# EAGLE design kiln_rpi_breakout_atmega328 (EAGLE 7.1.0)
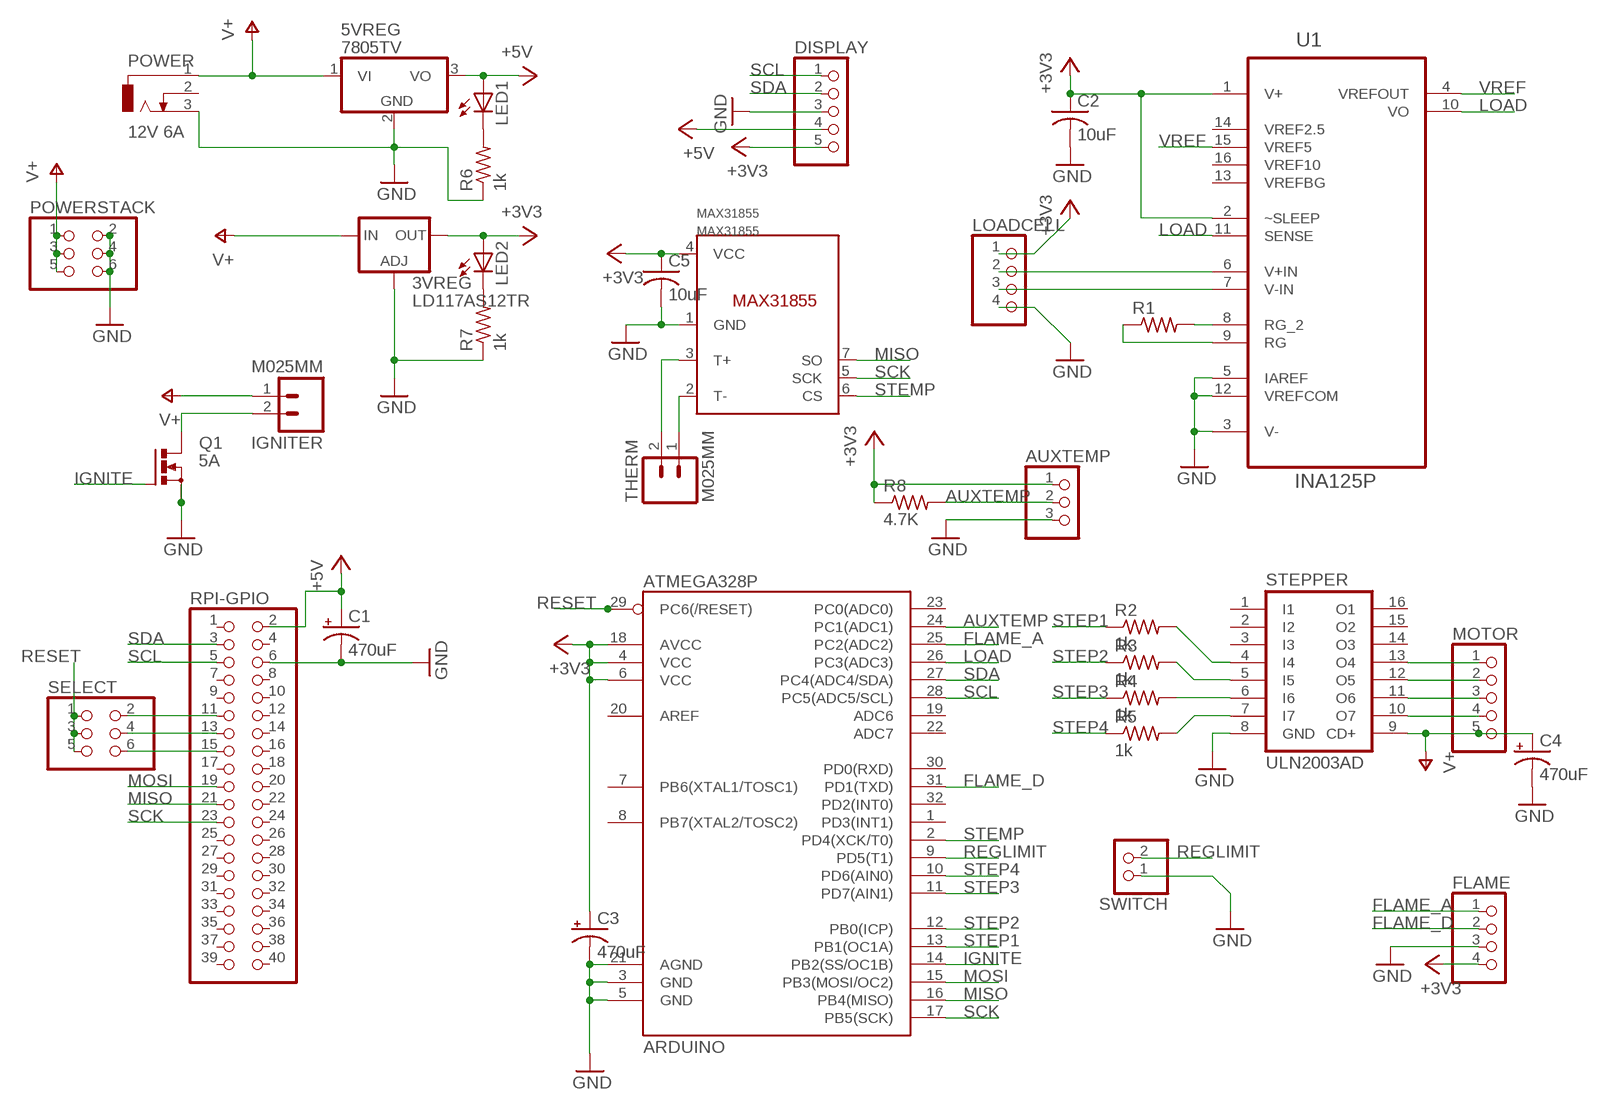
[diagram p0: schematic, sheet 1]

## Parts
3VREG  LD117AS12TR  [SOT223]
5VREG  7805TV  [TO220V]
ARDUINO  ATMEGA328P  ATMEGA328_SMT  [TQFP32-08]
AUXTEMP  PINHD-1X3  [1X03]
C1  470uF  CPOL-USE3.5-8  [E3,5-8]
C2  10uF  C-US025-030X050  [C025-030X050]
C3  470uF  CPOL-USE3.5-8  [E3,5-8]
C4  470uF  CPOL-USE3.5-8  [E3,5-8]
C5  10uF  C-US025-030X050  [C025-030X050]
DISPLAY  PINHD-1X5  [1X05]
FLAME  PINHD-1X4/90  [1X04/90]
IGNITER  M025MM  [SCREWTERMINAL-5MM-2]
LED1  LED3MM  [LED3MM]
LED2  LED3MM  [LED3MM]
LOADCELL  PINHD-1X4/90  [1X04/90]
MAX31855  MAX31855  [SOIC8]
MOTOR  PINHD-1X5/90  [1X05/90]
POWER  12V 6A  DCJ0303  [DCJ0303]
POWERSTACK  PINHD-2X3  [2X03]
Q1  5A  PMOSFET_NTO220BV  [TO220BV]
R1  R-US_0204/7  [0204/7]
R2  1k  R-US_0207/7  [0207/7]
R3  1k  R-US_0207/7  [0207/7]
R4  1k  R-US_0207/7  [0207/7]
R5  1k  R-US_0207/7  [0207/7]
R6  1k  R-US_0207/7  [0207/7]
R7  1k  R-US_0207/7  [0207/7]
R8  4.7K  R-US_0207/2V  [0207/2V]
RPI-GPIO  PINHD-2X20  [2X20]
SELECT  PINHD-2X3  [2X03]
STEPPER  ULN2003AD  [SO16]
SWITCH  PINHD-1X2/90  [1X02/90]
THERM  M025MM  [SCREWTERMINAL-5MM-2]
U1  INA125P  [DIP254P762X508-16]

## Nets
+3V3: 3VREG.4(OUT) ARDUINO.4(VCC) ARDUINO.6(VCC) ARDUINO.18(AVCC) AUXTEMP.1 C2.1 C3.+ C5.1 DISPLAY.5 FLAME.4 LED2.A LOADCELL.1 MAX31855.4(VCC) R8.1 U1.1(V+) U1.2(~SLEEP)
+5V: 5VREG.3(VO) C1.+ DISPLAY.4 LED1.A RPI-GPIO.2
AUXTEMP: ARDUINO.24(PC1(ADC1)) AUXTEMP.2 R8.2
FLAME_A: ARDUINO.25(PC2(ADC2)) FLAME.1
FLAME_D: ARDUINO.31(PD1(TXD)) FLAME.2
GND: 3VREG.1(ADJ) 5VREG.2(GND) ARDUINO.3(GND) ARDUINO.5(GND) ARDUINO.21(AGND) AUXTEMP.3 C1.- C2.2 C3.- C4.- C5.2 DISPLAY.3 FLAME.3 LOADCELL.4 MAX31855.1(GND) POWER.3 POWERSTACK.2 POWERSTACK.4 POWERSTACK.6 Q1.S R6.1 R7.1 RPI-GPIO.6 STEPPER.8(GND) SWITCH.1 U1.3(V-) U1.5(IAREF) U1.12(VREFCOM)
IGNITE: ARDUINO.14(PB2(SS/OC1B)) Q1.G
LOAD: ARDUINO.26(PC3(ADC3)) U1.10(VO) U1.11(SENSE)
MISO: ARDUINO.16(PB4(MISO)) MAX31855.7(SO) RPI-GPIO.21
MOSI: ARDUINO.15(PB3(MOSI/OC2)) RPI-GPIO.19
N$1: MOTOR.1 STEPPER.13(O4)
N$2: MOTOR.2 STEPPER.12(O5)
N$3: MOTOR.3 STEPPER.11(O6)
N$4: MOTOR.4 STEPPER.10(O7)
N$5: LED1.K(C) R6.2
N$6: LOADCELL.2 U1.6(V+IN)
N$7: LOADCELL.3 U1.7(V-IN)
N$8: MAX31855.3(T+) THERM.2
N$9: IGNITER.2 Q1.D
N$10: R1.2 U1.8(RG_2)
N$11: R5.2 STEPPER.7(I7)
N$12: R4.2 STEPPER.6(I6)
N$13: R3.2 STEPPER.5(I5)
N$14: R2.2 STEPPER.4(I4)
N$15: R1.1 U1.9(RG)
N$16: MAX31855.2(T-) THERM.1
N$17: LED2.K(C) R7.2
REGLIMIT: ARDUINO.9(PD5(T1)) SWITCH.2
RESET: ARDUINO.29(PC6(/RESET)) SELECT.1 SELECT.3 SELECT.5
RESET1: RPI-GPIO.11 SELECT.2
RESET2: RPI-GPIO.13 SELECT.4
RESET3: RPI-GPIO.15 SELECT.6
SCK: ARDUINO.17(PB5(SCK)) MAX31855.5(SCK) RPI-GPIO.23
SCL: ARDUINO.28(PC5(ADC5/SCL)) DISPLAY.1 RPI-GPIO.5
SDA: ARDUINO.27(PC4(ADC4/SDA)) DISPLAY.2 RPI-GPIO.3
STEMP: ARDUINO.2(PD4(XCK/T0)) MAX31855.6(CS)
STEP1: ARDUINO.13(PB1(OC1A)) R2.1
STEP2: ARDUINO.12(PB0(ICP)) R3.1
STEP3: ARDUINO.11(PD7(AIN1)) R4.1
STEP4: ARDUINO.10(PD6(AIN0)) R5.1
V+: 3VREG.3(IN) 5VREG.1(VI) C4.+ IGNITER.1 MOTOR.5 POWER.1 POWERSTACK.1 POWERSTACK.3 POWERSTACK.5 STEPPER.9(CD+)
VREF: U1.4(VREFOUT) U1.15(VREF5)
Unconnected: ARDUINO.1(PD3(INT1)) ARDUINO.7(PB6(XTAL1/TOSC1)) ARDUINO.8(PB7(XTAL2/TOSC2)) ARDUINO.19(ADC6) ARDUINO.20(AREF) ARDUINO.22(ADC7) ARDUINO.23(PC0(ADC0)) ARDUINO.30(PD0(RXD)) ARDUINO.32(PD2(INT0)) POWER.2 RPI-GPIO.1 RPI-GPIO.4 RPI-GPIO.7 RPI-GPIO.8 RPI-GPIO.9 RPI-GPIO.10 RPI-GPIO.12 RPI-GPIO.14 RPI-GPIO.16 RPI-GPIO.17 RPI-GPIO.18 RPI-GPIO.20 RPI-GPIO.22 RPI-GPIO.24 RPI-GPIO.25 RPI-GPIO.26 RPI-GPIO.27 RPI-GPIO.28 RPI-GPIO.29 RPI-GPIO.30 RPI-GPIO.31 RPI-GPIO.32 RPI-GPIO.33 RPI-GPIO.34 RPI-GPIO.35 RPI-GPIO.36 RPI-GPIO.37 RPI-GPIO.38 RPI-GPIO.39 RPI-GPIO.40 STEPPER.1(I1) STEPPER.2(I2) STEPPER.3(I3) STEPPER.14(O3) STEPPER.15(O2) STEPPER.16(O1)

## Power pins joined to a net without a drawn wire
VREF2.5: U1.14(VREF2.5)
VREF10: U1.16(VREF10)
VREFBG: U1.13(VREFBG)

## Library data of the parts
3VREG = v-reg:LD117A?*: Low drop fixed and adjustable positive voltage regulators 1 A Source: http://www.st.com/stonline/products/literature/ds/7194/ld1117axx.pdf
5VREG = linear:78*: Positive VOLTAGE REGULATOR Source: http://cache.national.com/ds/LM/LM78L05.pdf http://www.fairchildsemi.com/ds/LM/LM7805.pdf
ARDUINO = SparkFun-DigitalIC:ATMEGA328_SMT: 32-Pin Atmega328 part Commonly used on Arduino compatible boards Available in QFP and QFN packages TQFP is IC-09069 QFN is non-stock; PROD_ID: IC-09069
AUXTEMP = pinhead:PINHD-1X3: PIN HEADER
C1 C3 C4 = rcl:CPOL-US: POLARIZED CAPACITOR, American symbol
C2 C5 = rcl:C-US: CAPACITOR, American symbol
DISPLAY MOTOR = pinhead:PINHD-1X5: PIN HEADER
FLAME LOADCELL = pinhead:PINHD-1X4: PIN HEADER
IGNITER THERM = SparkFun-Connectors:M02: Standard 2-pin 0.1" header. Use with - straight break away headers ( PRT-00116) - right angle break away headers (PRT-00553) - swiss pins (PRT-00743) - machine pins (PRT-00117) - female headers (PRT-00115) Molex polarized connector foot print use with: PRT-08233 with associated crimp pins and housings. 2.54_SCREWTERM for use with PRT-10571. 3.5mm Screw Terminal footprints for PRT-08084 5mm Screw Terminal footprints for use with PRT-08432; STOREFRONT_ID: PRT-08432
LED1 LED2 = led:LED: LED OSRAM: - CHIPLED LG R971, LG N971, LY N971, LG Q971, LY Q971, LO R971, LY R971 LH N974, LH R974 LS Q976, LO Q976, LY Q976 LO Q996 - Hyper CHIPLED LW Q18S LB Q993, LB Q99A, LB R99A - SideLED LS A670, LO A670, LY A670, LG A670, LP A670 LB A673, LV A673, LT A673, LW A673 LH A674 LY A675 LS A676, LA A676, LO A676, LY A676, LW A676 LS A679, LY A679, LG A679 - Hyper Micro SIDELED® LS Y876, LA Y876, LO Y876, LY Y876 LT Y87S - SmartLED LW L88C, LW L88S LB L89C, LB L89S, LG L890 LS L89K, LO L89K, LY L89K LS L896, LA L896, LO L896, LY L896 - TOPLED LS T670, LO T670, LY T670, LG T670, LP T670 LSG T670, LSP T670, LSY T670, LOP T670, LYG T670 LG T671, LOG T671, LSG T671 LB T673, LV T673, LT T673, LW T673 LH T674 LS T676, LA T676, LO T676, LY T676, LB T676, LH T676, LSB T676, LW T676 LB T67C, LV T67C, LT T67C, LS T67K, LO T67K, LY T67K, LW E67C LS E67B, LA E67B, LO E67B, LY E67B, LB E67C, LV E67C, LT E67C LW T67C LS T679, LY T679, LG T679 LS T770, LO T770, LY T770, LG T770, LP T770 LB T773, LV T773, LT T773, LW T773 LH T774 LS E675, LA E675, LY E675, LS T675 LS T776, LA T776, LO T776, LY T776, LB T776 LHGB T686 LT T68C, LB T68C - Hyper Mini TOPLED® LB M676 - Mini TOPLED Santana® LG M470 LS M47K, LO M47K, LY M47K Source: http://www.osram.convergy.de LUXEON: - LUMILED® LXK2-PW12-R00, LXK2-PW12-S00, LXK2-PW14-U00, LXK2-PW14-V00 LXK2-PM12-R00, LXK2-PM12-S00, LXK2-PM14-U00 LXK2-PE12-Q00, LXK2-PE12-R00, LXK2-PE12-S00, LXK2-PE14-T00, LXK2-PE14-U00 LXK2-PB12-K00, LXK2-PB12-L00, LXK2-PB12-M00, LXK2-PB14-N00, LXK2-PB14-P00, LXK2-PB14-Q00 LXK2-PR12-L00, LXK2-PR12-M00, LXK2-PR14-Q00, LXK2-PR14-R00 LXK2-PD12-Q00, LXK2-PD12-R00, LXK2-PD12-S00 LXK2-PH12-R00, LXK2-PH12-S00 LXK2-PL12-P00, LXK2-PL12-Q00, LXK2-PL12-R00 Source: www.luxeon.com KINGBRIGHT: KA-3528ASYC Source: www.kingbright.com
MAX31855 = AlexW-Eagle-Libraries:MAX31855
POWER = con-jack:DCJ0303: DC POWER JACK Source: DCJ0303.pdf; OC_FARNELL: unknown; OC_NEWARK: unknown
POWERSTACK SELECT = pinhead:PINHD-2X3: PIN HEADER
Q1 = transistor-power:PMOSFET_N: Power MOSFET N-Channel
R1-R8 = rcl:R-US_: RESISTOR, American symbol
RPI-GPIO = pinhead:PINHD-2X20: PIN HEADER
STEPPER = uln-udn:ULN2003A: DRIVER ARRAY
SWITCH = pinhead:PINHD-1X2: PIN HEADER
U1 = Texas Instruments_By_element14_Batch_1:INA125P: INSTRUMENTATION AMPLIFIER; MPN: INA125P; OC_FARNELL: 1459461; OC_NEWARK: 35C1726; PACKAGE: PDIP-16; SUPPLIER: Texas Instruments

## Net classes
0 default: width 0.406 mm, clearance 0.203 mm

## Board
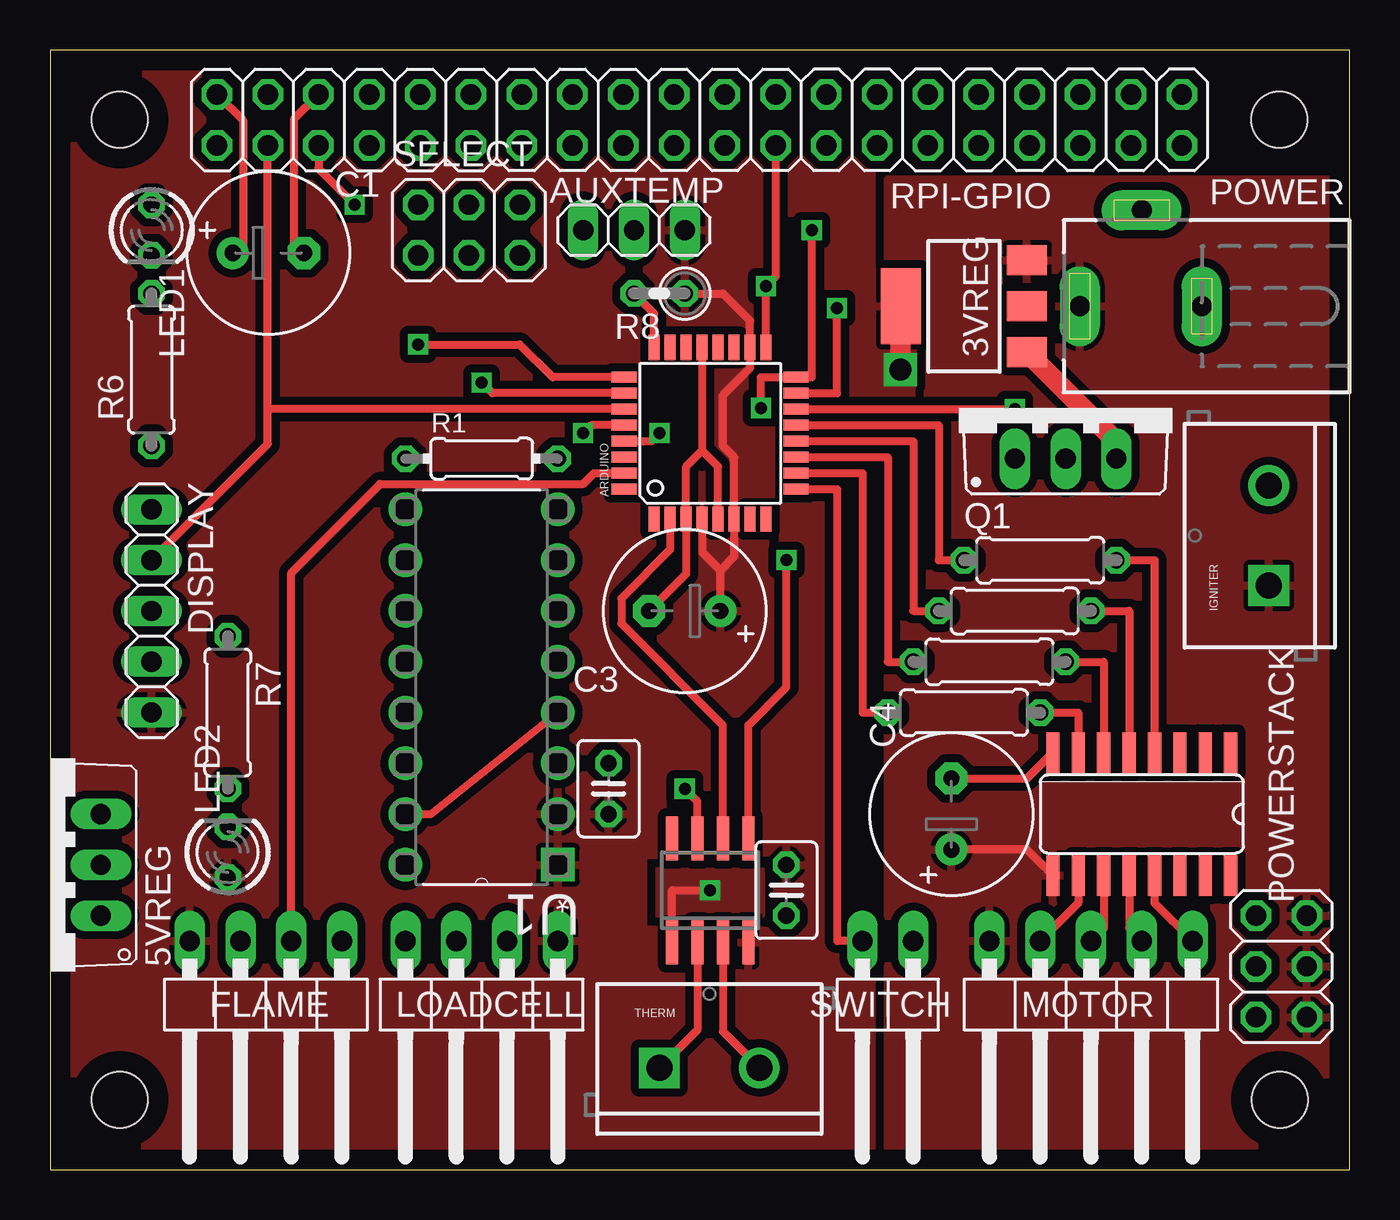
[diagram p1: board, top side]
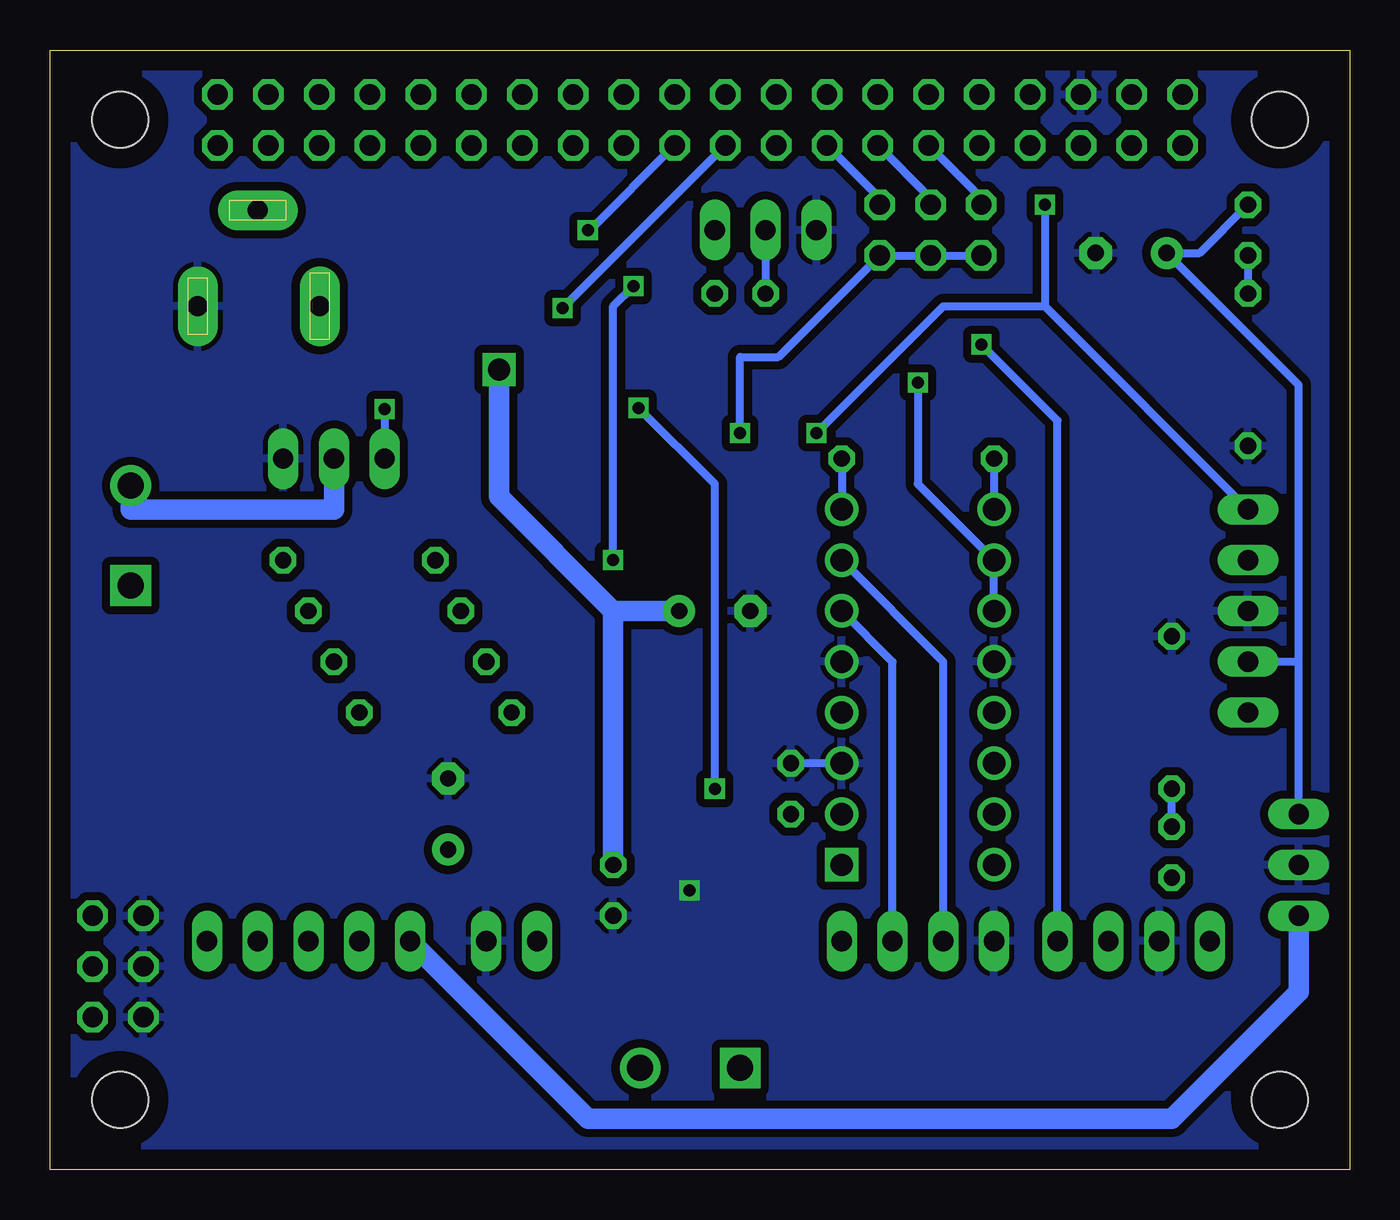
[diagram p2: board, bottom side, seen from below]

Size 65 x 56 mm. Coordinates in mm from the lower left corner, seen from the top.
Outline: 0,0 65,0 65,56 0,56 0,0
Copper layers (1*16): Top 0.035mm / dielectric 1.5mm / Bottom 0.035mm
Design rules "default": minimum track width 10mil, minimum drill 24mil, track to track 8mil, track to pad 8mil, pad to pad 8mil, via to via 8mil, smd to smd 8mil, copper to edge 40mil, drill to drill 8mil, minimum pad ring 10mil, minimum via ring 8mil, stop-mask expansion 4mil, vias tented up to drill 0mil, thermal gap 10mil
Holes 2.8 mm at 3.5,52.5 61.5,52.5 61.5,3.5 3.5,3.5

### Footprints (pad centres in the part's own frame; a part is rotated, then mirrored left to right if it is on the bottom)
SOT223 = smd 1.5 x 2: 1 -2.3,-3.15; 2 0,-3.15; 3 2.3,-3.15 | smd 3.8 x 2: 4 0,3.15
TO220V = drill 1.016 long: 1 -2.54,-2.54; 2 0,-2.54; 3 2.54,-2.54
TQFP32-08 = smd 1.27 x 0.559: 1 -4.293,2.8; 2 -4.293,2; 3 -4.293,1.2; 4 -4.293,0.4; 5 -4.293,-0.4; 6 -4.293,-1.2; 7 -4.293,-2; 8 -4.293,-2.8; 17 4.293,-2.8; 18 4.293,-2; 19 4.293,-1.2; 20 4.293,-0.4; 21 4.293,0.4; 22 4.293,1.2; 23 4.293,2; 24 4.293,2.8 | smd 0.559 x 1.27: 9 -2.8,-4.293; 10 -2,-4.293; 11 -1.2,-4.293; 12 -0.4,-4.293; 13 0.4,-4.293; 14 1.2,-4.293; 15 2,-4.293; 16 2.8,-4.293; 25 2.8,4.293; 26 2,4.293; 27 1.2,4.293; 28 0.4,4.293; 29 -0.4,4.293; 30 -1.2,4.293; 31 -2,4.293; 32 -2.8,4.293
1X03 = drill 1.016 long: 1 -2.54,0; 2 0,0; 3 2.54,0
E3,5-8 = drill 0.813 pad 1.6: + -1.778,0 | drill 0.813 pad 1.6 octagon: - 1.778,0
C025-030X050 = drill 0.813 octagon: 1 -1.27,0; 2 1.27,0
1X05 = drill 1.016 long: 1 -5.08,0; 2 -2.54,0; 3 0,0; 4 2.54,0; 5 5.08,0
1X04/90 = drill 1.016 long: 1 -3.81,-3.81; 2 -1.27,-3.81; 3 1.27,-3.81; 4 3.81,-3.81
SCREWTERMINAL-5MM-2 = drill 1.3 pad 2.032 square: 1 0,0 | drill 1.3 pad 2.032: 2 5,0
LED3MM = drill 0.813 octagon: A -1.27,0; K 1.27,0
SOIC8 = smd 0.6 x 2.2: 1 -1.905,-2.6; 2 -0.635,-2.6; 3 0.635,-2.6; 4 1.905,-2.6; 5 1.905,2.6; 6 0.635,2.6; 7 -0.635,2.6; 8 -1.905,2.6
1X05/90 = drill 1.016 long: 1 -5.08,-3.81; 2 -2.54,-3.81; 3 0,-3.81; 4 2.54,-3.81; 5 5.08,-3.81
DCJ0303 = drill 1 pad 2 long: 1 0,3.1; 2 4.8,0; 3 0,-3
2X03 = drill 1.016 octagon: 1 -2.54,-1.27; 2 -2.54,1.27; 3 0,-1.27; 4 0,1.27; 5 2.54,-1.27; 6 2.54,1.27
TO220BV = drill 1.016 long: D 0,-2.54; G -2.54,-2.54; S 2.54,-2.54
0204/7 = drill 0.813 octagon: 1 -3.81,0; 2 3.81,0
0207/7 = drill 0.813 octagon: 1 -3.81,0; 2 3.81,0
0207/2V = drill 0.813 octagon: 1 -1.27,0; 2 1.27,0
2X20 = drill 1.016 octagon: 1 -24.13,-1.27; 2 -24.13,1.27; 3 -21.59,-1.27; 4 -21.59,1.27; 5 -19.05,-1.27; 6 -19.05,1.27; 7 -16.51,-1.27; 8 -16.51,1.27; 9 -13.97,-1.27; 10 -13.97,1.27; 11 -11.43,-1.27; 12 -11.43,1.27; 13 -8.89,-1.27; 14 -8.89,1.27; 15 -6.35,-1.27; 16 -6.35,1.27; 17 -3.81,-1.27; 18 -3.81,1.27; 19 -1.27,-1.27; 20 -1.27,1.27; 21 1.27,-1.27; 22 1.27,1.27; 23 3.81,-1.27; 24 3.81,1.27; 25 6.35,-1.27; 26 6.35,1.27; 27 8.89,-1.27; 28 8.89,1.27; 29 11.43,-1.27; 30 11.43,1.27; 31 13.97,-1.27; 32 13.97,1.27; 33 16.51,-1.27; 34 16.51,1.27; 35 19.05,-1.27; 36 19.05,1.27; 37 21.59,-1.27; 38 21.59,1.27; 39 24.13,-1.27; 40 24.13,1.27
SO16 = smd 0.66 x 2.032: 1 -4.445,-3.073; 2 -3.175,-3.073; 3 -1.905,-3.073; 4 -0.635,-3.073; 5 0.635,-3.073; 6 1.905,-3.073; 7 3.175,-3.073; 8 4.445,-3.073; 9 4.445,3.073; 10 3.175,3.073; 11 1.905,3.073; 12 0.635,3.073; 13 -0.635,3.073; 14 -1.905,3.073; 15 -3.175,3.073; 16 -4.445,3.073
1X02/90 = drill 1.016 long: 1 -1.27,-3.81; 2 1.27,-3.81
DIP254P762X508-16 = drill 1.118 square: 1 -7.62,17.78 | drill 1.118: 2 -7.62,15.24; 3 -7.62,12.7; 4 -7.62,10.16; 5 -7.62,7.62; 6 -7.62,5.08; 7 -7.62,2.54; 8 -7.62,0; 9 0,0; 10 0,2.54; 11 0,5.08; 12 0,7.62; 13 0,10.16; 14 0,12.7; 15 0,15.24; 16 0,17.78

### Placement (x,y rotation side)
3VREG  45.72,43.18 90 top
5VREG  0,15.24 90 top
ARDUINO  33.02,36.83 90 top
AUXTEMP  29.21,46.99 180 top
C1  10.92,45.85 0 top
C2  27.94,19.05 90 top
C3  31.75,27.94 180 top
C4  45.09,17.78 90 top
C5  36.83,13.97 270 top
DISPLAY  5.08,27.94 270 top
FLAME  10.79,7.62 180 top
IGNITER  60.96,29.21 90 top
LED1  5.08,46.99 270 top
LED2  8.89,15.88 90 top
LOADCELL  21.59,7.62 180 top
MAX31855  33.02,13.97 0 top
MOTOR  52.07,7.62 180 top
POWER  54.61,43.18 90 top
POWERSTACK  61.59,10.16 90 top
Q1  50.8,38.1 0 top
R1  21.59,35.56 0 top
R2  49.53,30.48 0 top
R3  48.26,27.94 0 top
R4  46.99,25.4 0 top
R5  45.72,22.86 0 top
R6  5.08,40.01 90 top
R7  8.89,22.86 270 top
R8  30.48,43.81 180 top
RPI-GPIO  32.49,52.5 0 top
SELECT  20.95,46.99 0 top
STEPPER  54.61,17.78 180 top
SWITCH  41.91,7.62 180 top
THERM  30.48,5.08 0 top
U1  17.78,33.02 180 top

### Tracks (layer width: path | path; a pad name or v marks a point on that pad's centre or on a via)
+3V3  (via drill 1.1)
  Top 0.406: ARDUINO.4 32.62,30.88 33.53,29.97 | C3.+ 33.53,29.97 | 33.53,29.97 34.22,30.66 ARDUINO.6 34.22,35.63 33.66,36.2 33.66,38.73 35.02,40.1 ARDUINO.18 35.02,42.45 33.66,43.81 R8.1
  Top 1.016: 3VREG.4 42.55,43.18 v42.55,40.01
  Bottom 1.016: 42.57,40.01 v42.55,40.01 42.55,33.66 36.83,27.94 | C3.+ 36.83,27.94 | C5.1 36.83,27.94
  pour Top (isolate 0.406, rank 3): 0,55.88 64.77,55.88 64.77,0 0,0
+5V
  Top 0.406: RPI-GPIO.2 9.65,52.48 9.65,45.85 C1.+
  Bottom 0.406: 5VREG.3 2.54,25.4 | 2.54,25.4 DISPLAY.4 | 2.54,25.4 2.54,39.24 C1.+ 7.49,45.85 LED1.A
AUXTEMP
  Top 0.406: ARDUINO.24 30.22,42.8 R8.2
  Bottom 0.406: AUXTEMP.2 R8.2
FLAME_A  (via drill 0.6)
  Top 0.406: v18.41,41.27 23.5,41.27 25.14,39.63 ARDUINO.25
  Bottom 0.406: FLAME.1 14.61,37.47 v18.41,41.27
FLAME_D
  Top 0.406: ARDUINO.31 27.21,34.83 26.67,34.29 16.51,34.29 12.06,29.84 FLAME.2
GND  (via drill 0.6)
  Top 0.406: RPI-GPIO.6 12.19,52.53 12.19,45.85 C1.- | C4.- 48.87,19.56 STEPPER.8 | ARDUINO.21 32.62,35.96 | ARDUINO.5 33.42,35.16 32.62,35.96 | 32.62,35.96 31.82,35.16 ARDUINO.3 31.82,29.79 C3.- | MAX31855.1 31.11,13.97 v33.02,13.97
  Top 1.016: 3VREG.1 53.34,36.41 Q1.S
  Bottom 0.406: U1.3 C2.2
  pour Bottom (isolate 0.406): 0,55.88 64.77,55.88 64.77,0 0,0
  pour Top (isolate 0.406, rank 2): 30.48,15.24 35.56,15.24 35.56,12.7 30.48,12.7
IGNITE  (via drill 0.6)
  Top 0.406: ARDUINO.14 v48.26,38.03
  Bottom 0.406: v48.26,38.03 Q1.G
LOAD  (via drill 0.6)
  Top 0.406: ARDUINO.26 22.13,38.83 v21.59,39.37
  Bottom 0.406: v21.59,39.37 21.59,34.29 U1.10 U1.11
MISO  (via drill 0.6)
  Top 0.406: MAX31855.7 32.38,18.41 v31.75,19.05 | v35.56,38.1 35.56,39.63 ARDUINO.16 38.1,39.63 v38.1,46.99
  Bottom 0.406: v31.75,19.05 31.75,34.29 v35.56,38.1 | v38.1,46.99 38,46.99 RPI-GPIO.21
MOSI  (via drill 0.6)
  Top 0.406: ARDUINO.15 39.37,38.83 v39.37,43.08
  Bottom 0.406: v39.37,43.08 RPI-GPIO.19
N$1
  Top 0.406: STEPPER.13 55.24,13.34 MOTOR.1
N$2
  Top 0.406: STEPPER.12 53.98,12.06 MOTOR.2
N$3
  Top 0.406: STEPPER.11 52.7,12.06 MOTOR.3
N$4
  Top 0.406: STEPPER.10 51.44,13.34 MOTOR.4
N$5
  Bottom 0.406: LED1.K R6.2
N$6
  Bottom 0.406: LOADCELL.2 22.86,25.4 U1.6
N$7
  Bottom 0.406: LOADCELL.3 20.32,25.4 U1.7
N$8
  Top 0.406: MAX31855.3 33.66,6.91 THERM.2
N$9
  Bottom 1.016: Q1.D 50.8,33.02 60.96,33.02 IGNITER.2
N$10
  Bottom 0.406: R1.2 U1.8
N$11
  Top 0.406: R5.2 51.44,22.86 STEPPER.7
N$12
  Top 0.406: R4.2 52.7,25.4 STEPPER.6
N$13
  Top 0.406: R3.2 53.98,27.94 STEPPER.5
N$14
  Top 0.406: R2.2 55.24,30.48 STEPPER.4
N$15
  Bottom 0.406: R1.1 U1.9
N$16
  Top 0.406: MAX31855.2 32.38,6.99 THERM.1
N$17
  Bottom 0.406: LED2.K R7.2
REGLIMIT
  Top 0.406: ARDUINO.9 39.37,34.03 39.37,11.43 SWITCH.2
RESET  (via drill 0.6)
  Top 0.406: ARDUINO.29 30.08,36.43 v30.48,36.83
  Bottom 0.406: v30.48,36.83 30.48,40.64 28.57,40.64 SELECT.5 SELECT.3 SELECT.1
RESET1
  Bottom 0.406: SELECT.2 18.41,48.59 RPI-GPIO.11
RESET2
  Bottom 0.406: SELECT.4 20.95,48.59 RPI-GPIO.13
RESET3
  Bottom 0.406: SELECT.6 23.5,48.59 RPI-GPIO.15
SCK  (via drill 0.6)
  Top 0.406: ARDUINO.17 v35.82,44.19 36.3,44.67 RPI-GPIO.23 | MAX31855.5 34.92,22.23 36.83,24.13 v36.83,30.48
  Bottom 0.406: v36.83,30.48 36.83,43.18 v35.82,44.19
SCL  (via drill 0.6)
  Top 0.406: RPI-GPIO.5 13.44,50.06 v15.24,48.26 | ARDUINO.28 27.07,37.23 v26.67,36.83
  Bottom 0.406: v15.24,48.26 15.24,43.18 | 15.24,43.18 DISPLAY.1 | v26.67,36.83 20.32,43.18 15.24,43.18
SDA
  Top 0.406: DISPLAY.2 10.9,36.3 10.9,38.1 | 10.9,38.1 RPI-GPIO.3 | ARDUINO.27 10.97,38.03 10.9,38.1
STEMP
  Top 0.406: ARDUINO.2 31.02,31.02 28.57,28.57 28.57,27.3 33.66,22.23 MAX31855.6
STEP1
  Top 0.406: ARDUINO.13 44.45,37.23 44.45,30.48 R2.1
STEP2
  Top 0.406: ARDUINO.12 43.18,36.43 43.18,27.94 R3.1
STEP3
  Top 0.406: ARDUINO.11 41.91,35.63 41.91,25.4 R4.1
STEP4
  Top 0.406: ARDUINO.10 40.64,34.83 40.64,22.86 R5.1
V+
  Top 0.406: STEPPER.9 48.87,16 C4.+
  Bottom 1.016: MOTOR.5 38.1,2.54 8.89,2.54 2.54,8.89 5VREG.1
  pour Top (isolate 0.406): 41.91,49.53 64.77,49.53 64.77,0 41.91,0
VREF
  Top 0.406: U1.15 19.05,17.78 U1.4